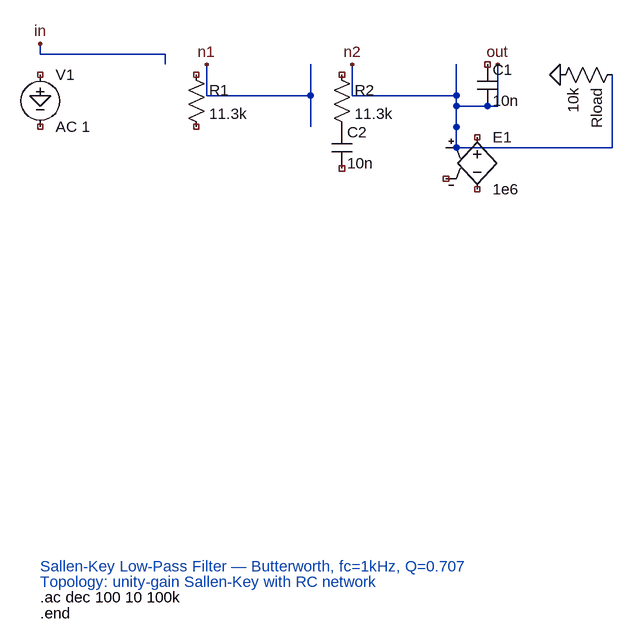
[diagram p0: schematic sallen_key_lpf.asc]
sallen_key_lpf.asc, the LTspice schematic file:
Version 4
SHEET 1 1600 1200
WIRE 256 256 256 240
WIRE 320 256 320 304
WIRE 320 304 480 304
WIRE 480 256 480 304
WIRE 480 352 480 304
WIRE 544 256 544 304
WIRE 544 304 704 304
WIRE 64 224 64 240
WIRE 64 240 256 240
WIRE 704 256 704 304
WIRE 704 320 768 320
WIRE 704 352 704 304
WIRE 704 384 704 320
WIRE 768 256 768 320
WIRE 688 384 944 384
WIRE 944 384 944 272
FLAG 64 224 in
FLAG 64 304 0
FLAG 320 256 n1
FLAG 544 256 n2
FLAG 768 256 out
FLAG 864 272 0
SYMBOL voltage 64 256 R0
SYMATTR InstName V1
SYMATTR Value AC 1
SYMBOL res 288 256 R0
SYMATTR InstName R1
SYMATTR Value 11.3k
SYMBOL res 512 256 R0
SYMATTR InstName R2
SYMATTR Value 11.3k
SYMBOL cap 736 256 R0
SYMATTR InstName C1
SYMATTR Value 10n
SYMBOL cap 512 352 R0
SYMATTR InstName C2
SYMATTR Value 10n
SYMBOL e 736 352 R0
SYMATTR InstName E1
SYMATTR Value 1e6
SYMBOL res 960 256 R90
SYMATTR InstName Rload
SYMATTR Value 10k
TEXT 64 1100 Left 2 !.end
TEXT 64 1076 Left 2 !.ac dec 100 10 100k
TEXT 64 1052 Left 2 ;Topology: unity-gain Sallen-Key with RC network
TEXT 64 1028 Left 2 ;Sallen-Key Low-Pass Filter — Butterworth, fc=1kHz, Q=0.707

The netlist it stands for:
* sallen_key_lpf.asc
V1 NC_01 NC_02 AC 1
R1 NC_03 NC_04 11.3k
R2 NC_05 P001 11.3k
C1 NC_06 out 10n
C2 P001 NC_07 10n
E1 NC_08 NC_09 out NC_10 1e6
Rload out 0 10k
.end
.ac dec 100 10 100k
* Topology: unity-gain Sallen-Key with RC network
* Sallen-Key Low-Pass Filter — Butterworth, fc=1kHz, Q=0.707
.backanno
.end